# Altium schematic sheet ETHERNET.SchDoc
size C; SheetNumber: 8; SheetTotal: 10
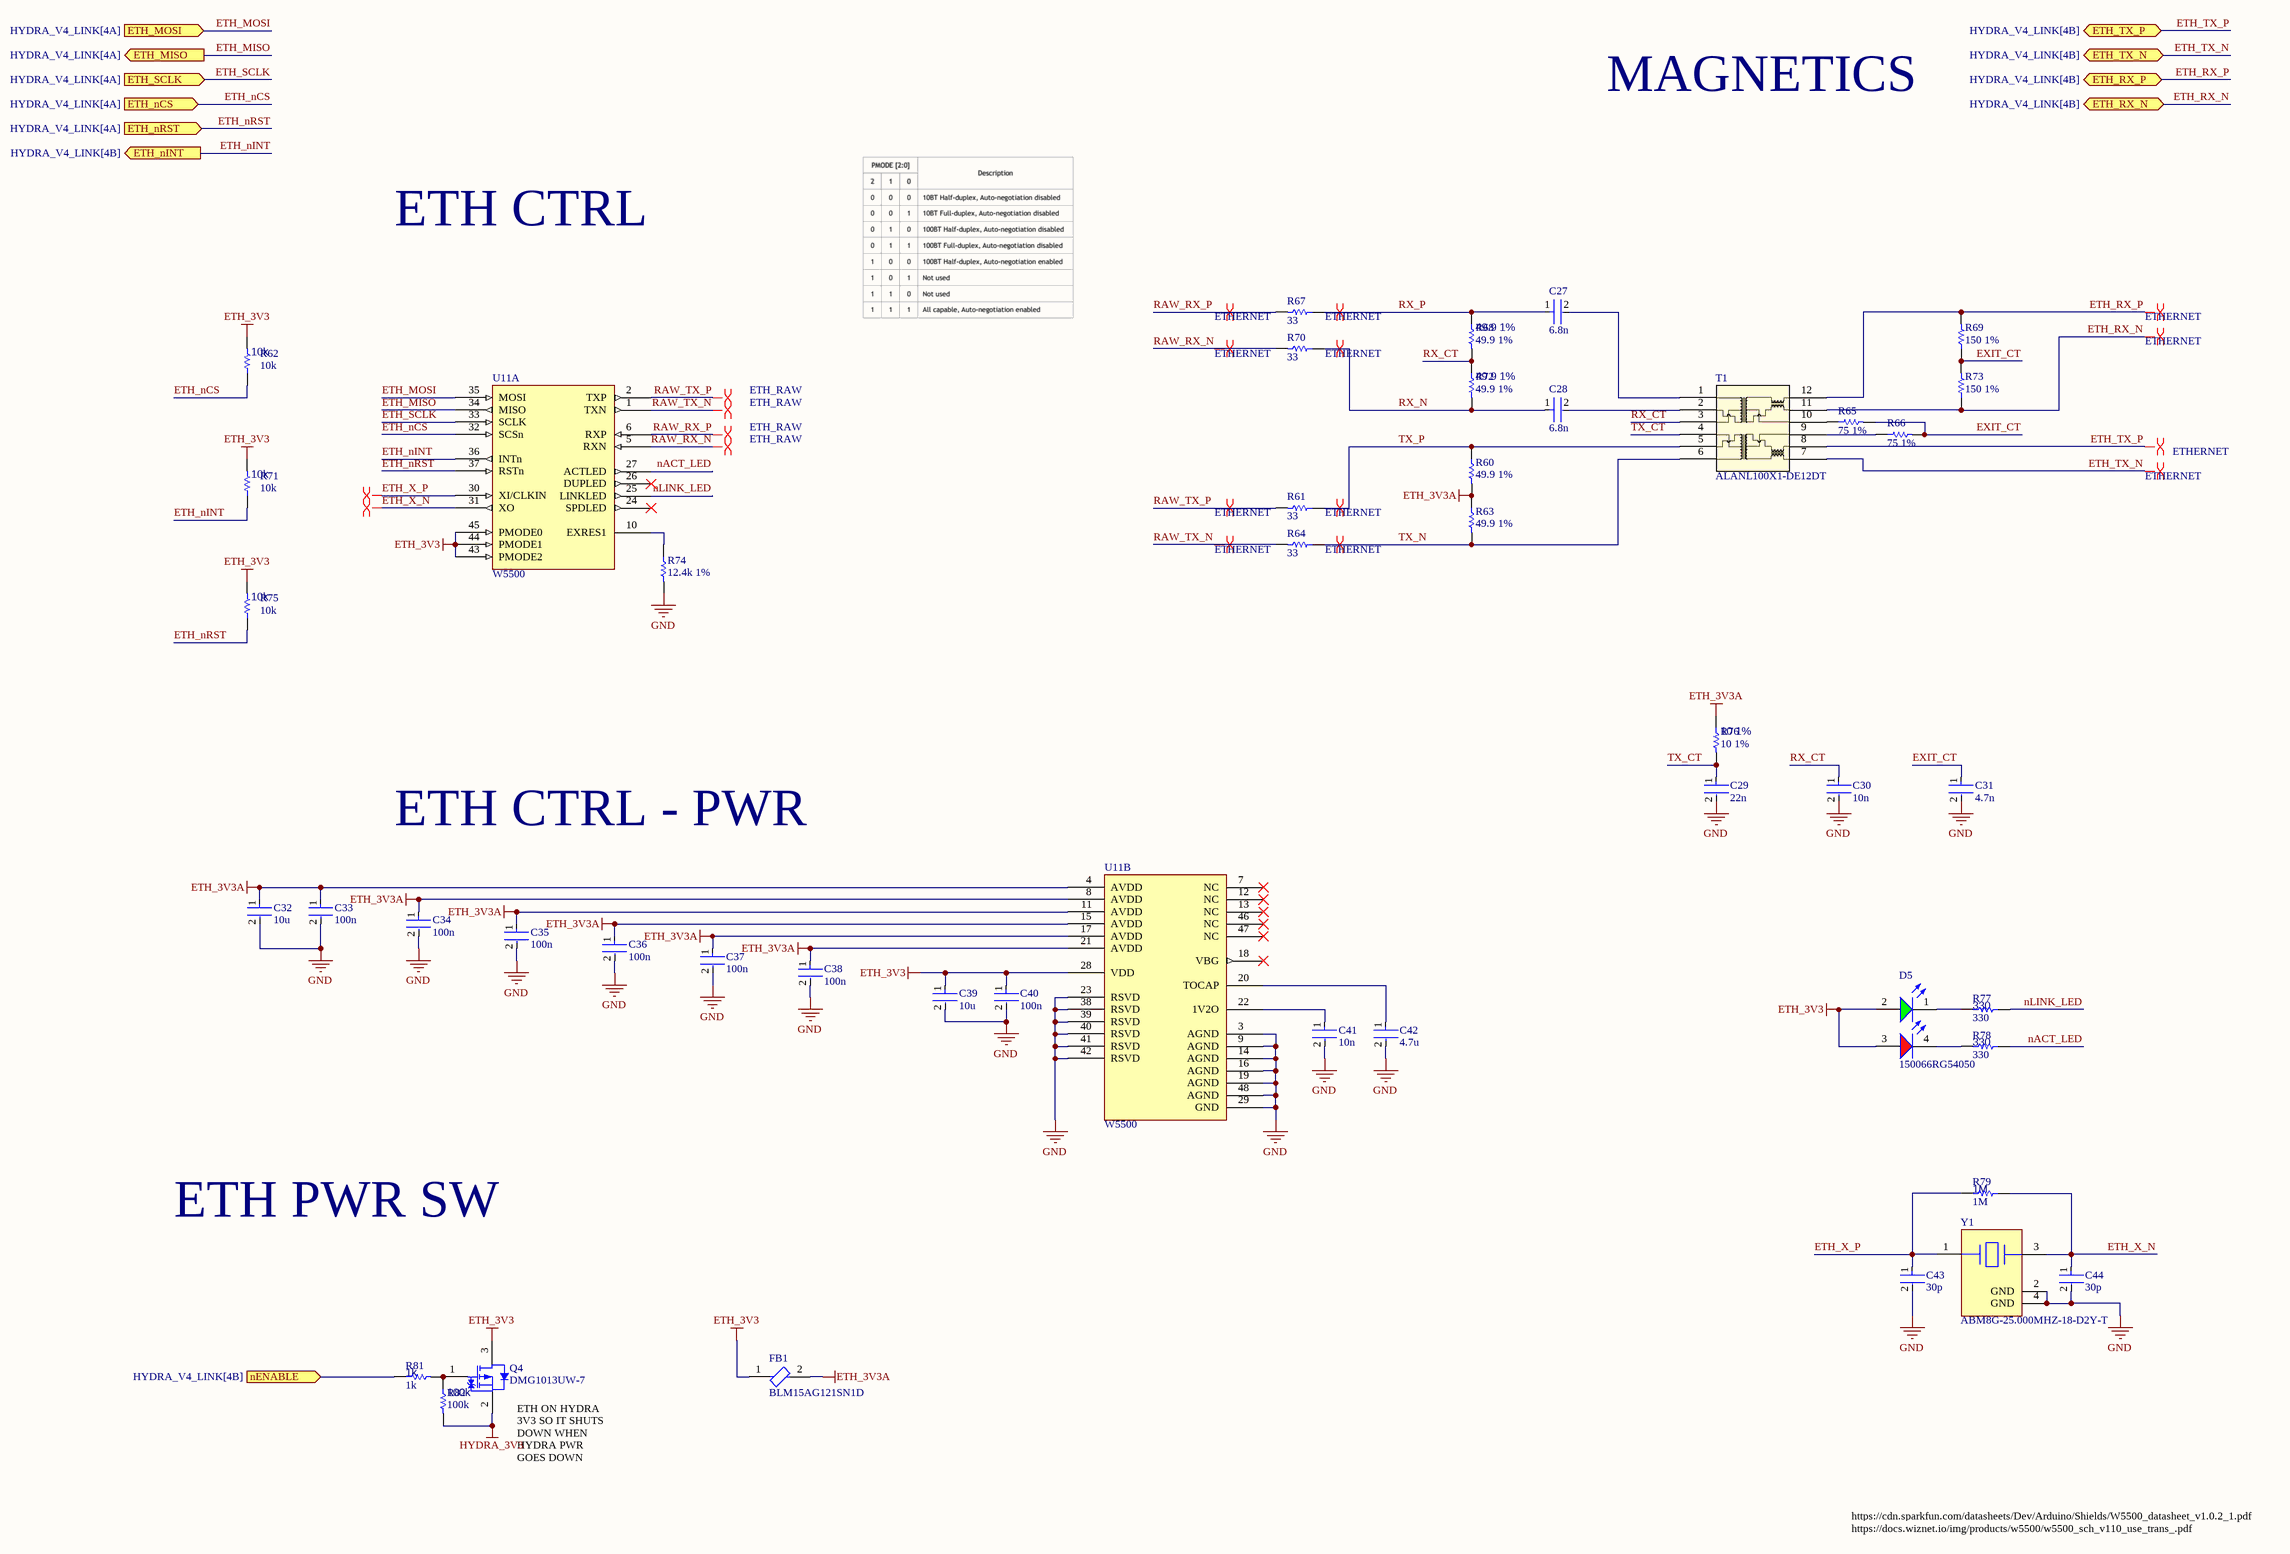
[diagram p0: ETHERNET.SchDoc]

## Parts
C27  6.8n  [FP-0402-L_1_0_0_05-W_0_5-IPC_A]
C28  6.8n  [FP-0402-L_1_0_0_05-W_0_5-IPC_A]
C29  22n  [FP-0402-L_1_0_0_05-W_0_5-IPC_A]
C30  10n  [FP-0402-L_1_0_0_05-W_0_5-IPC_A]
C31  4.7n  [FP-0402-L_1_0_0_05-W_0_5-IPC_A]
C32  10u  [FP-0402-L_1_0_0_05-W_0_5-IPC_A]
C33  100n  [FP-0402-L_1_0_0_05-W_0_5-IPC_A]
C34  100n  [FP-0402-L_1_0_0_05-W_0_5-IPC_A]
C35  100n  [FP-0402-L_1_0_0_05-W_0_5-IPC_A]
C36  100n  [FP-0402-L_1_0_0_05-W_0_5-IPC_A]
C37  100n  [FP-0402-L_1_0_0_05-W_0_5-IPC_A]
C38  100n  [FP-0402-L_1_0_0_05-W_0_5-IPC_A]
C39  10u  [FP-0402-L_1_0_0_05-W_0_5-IPC_A]
C40  100n  [FP-0402-L_1_0_0_05-W_0_5-IPC_A]
C41  10n  [FP-0402-L_1_0_0_05-W_0_5-IPC_A]
C42  4.7u  [FP-0402-L_1_0_0_05-W_0_5-IPC_A]
C43  30p  [FP-0402-L_1_0_0_05-W_0_5-IPC_A]
C44  30p  [FP-0402-L_1_0_0_05-W_0_5-IPC_A]
D5  150066RG54050  [WL-SBCD_0606]
FB1  BLM15AG121SN1D  [FP-BLM15-0_05-MFG]
Q4  DMG1013UW-7  [DIOD-SOT323-3_V]
R60  49.9 1%  [R0603B]
R61  33  [R0603B]
R62  10k  [R0603B]
R63  49.9 1%  [R0603B]
R64  33  [R0603B]
R65  75 1%  [R0603B]
R66  75 1%  [R0603B]
R67  33  [R0603B]
R68  49.9 1%  [R0603B]
R69  150 1%  [R0603B]
R70  33  [R0603B]
R71  10k  [R0603B]
R72  49.9 1%  [R0603B]
R73  150 1%  [R0603B]
R74  12.4k 1%  [R0603B]
R75  10k  [R0603B]
R76  10 1%  [R0603B]
R77  330  [R0603B]
R78  330  [R0603B]
R79  1M  [R0603B]
R81  1k  [R0603B]
R82  100k  [R0603B]
T1  ALANL100X1-DE12DT  [ALANL100X1-DE12DT-Footprint-1]
U11  W5500  [TSQFP50P900X900X160-48N]  (parts A,B of 2)
Y1  ABM8G-25.000MHZ-18-D2Y-T  [FP-ABM8G-MFG]

## Ports
ETH_MISO (out, see HYDRA_V4_LINK[4A]), ETH_MOSI (in, see HYDRA_V4_LINK[4A]), ETH_nCS (in, see HYDRA_V4_LINK[4A]), ETH_nINT (out, see HYDRA_V4_LINK[4B]), ETH_nRST (in, see HYDRA_V4_LINK[4A]), ETH_RX_N (bidir, see HYDRA_V4_LINK[4B]), ETH_RX_P (bidir, see HYDRA_V4_LINK[4B]), ETH_SCLK (in, see HYDRA_V4_LINK[4A]), ETH_TX_N (bidir, see HYDRA_V4_LINK[4B]), ETH_TX_P (bidir, see HYDRA_V4_LINK[4B]), nENABLE (in, see HYDRA_V4_LINK[4B])

## Nets
ETH_3V3: C39.1 C40.1 D5.2(A) D5.3(A) FB1.1 Q4.3(D) R62.2 R71.2 R75.2 U11.28(VDD) U11.43(PMODE2) U11.44(PMODE1) U11.45(PMODE0)
ETH_3V3A: C32.1 C33.1 C34.1 C35.1 C36.1 C37.1 C38.1 FB1.2 R60.2 R63.1 R76.1 U11.4(AVDD) U11.8(AVDD) U11.11(AVDD) U11.15(AVDD) U11.17(AVDD) U11.21(AVDD)
GND: C29.2 C30.2 C31.2 C32.2 C33.2 C34.2 C35.2 C36.2 C37.2 C38.2 C39.2 C40.2 C41.2 C42.2 C43.2 C44.2 R74.2 U11.3(AGND) U11.9(AGND) U11.14(AGND) U11.16(AGND) U11.19(AGND) U11.23(RSVD) U11.29(GND) U11.38(RSVD) U11.39(RSVD) U11.40(RSVD) U11.41(RSVD) U11.42(RSVD) U11.48(AGND) Y1.2(GND) Y1.4(GND)
HYDRA_3V3: Q4.2(S) R82.2
ETH_MISO: U11.34(MISO) ; port ETH_MISO
ETH_MOSI: U11.35(MOSI) ; port ETH_MOSI
ETH_nCS: R62.1 U11.32(SCSn) ; port ETH_nCS
ETH_nINT: R71.1 U11.36(INTn) ; port ETH_nINT
ETH_nRST: R75.1 U11.37(RSTn) ; port ETH_nRST
ETH_RX_N: R73.1 T1.11(MX1-) ; port ETH_RX_N
ETH_RX_P: R69.2 T1.12(MX1+) ; port ETH_RX_P
ETH_SCLK: U11.33(SCLK) ; port ETH_SCLK
ETH_TX_N: T1.7(MX2-) ; port ETH_TX_N
ETH_TX_P: T1.8(MX2+) ; port ETH_TX_P
ETH_X_N: C44.1 R79.1 U11.31(XO) Y1.3
ETH_X_P: C43.1 R79.2 U11.30(XI/CLKIN) Y1.1
EXIT_CT: C31.1 R65.2 R66.2 R69.1 R73.2
nACT_LED: R78.1 U11.27(ACTLED)
nENABLE: R81.1 ; port nENABLE
nLINK_LED: R77.1 U11.25(LINKLED)
RAW_RX_N: R70.2 U11.5(RXN)
RAW_RX_P: R67.2 U11.6(RXP)
RAW_TX_N: R64.2 U11.1(TXN)
RAW_TX_P: R61.2 U11.2(TXP)
RX_CT: C30.1 R68.2 R72.1 T1.3(TCT1)
RX_N: C28.1 R70.1 R72.2
RX_P: C27.1 R67.1 R68.1
TX_CT: C29.1 R76.2 T1.4(TCT2)
TX_N: R63.2 R64.1 T1.6(TD2-)
TX_P: R60.1 R61.1 T1.5(TD2+)
NetC27_2: C27.2 T1.1(TD1+)
NetC28_2: C28.2 T1.2(TD1-)
NetC41_1: C41.1 U11.22(1V2O)
NetC42_1: C42.1 U11.20(TOCAP)
NetD5_1: D5.1(K) R77.2
NetD5_4: D5.4(K) R78.2
NetQ4_1: Q4.1(G) R81.2 R82.1
NetR65_1: R65.1 T1.10(MCT1)
NetR66_1: R66.1 T1.9(MCT2)
NetR74_1: R74.1 U11.10(EXRES1)

Not connected (* = marked no-connect by the designer): U11 7(NC)* 12(NC)* 13(NC)* 18(VBG)* 24(SPDLED)* 26(DUPLED)* 46(NC)* 47(NC)*

## Layout directives
differential pair; differential pair class ETH_RAW: RAW_RX_N, RAW_RX_P, RAW_TX_N, RAW_TX_P
differential pair; differential pair class ETHERNET: ETH_RX_N, ETH_RX_P, ETH_TX_N, ETH_TX_P, RAW_RX_N, RAW_RX_P, RAW_TX_N, RAW_TX_P, RX_N, RX_P, TX_N, TX_P
differential pair: ETH_X_N, ETH_X_P

## Notes on the sheet
- MAGNETICS
- ETH CTRL
- ETH CTRL - PWR
- ETH PWR SW
- (near Q4) ETH ON HYDRA 3V3 SO IT SHUTS DOWN WHEN HYDRA PWR GOES DOWN
- https://cdn.sparkfun.com/datasheets/Dev/Arduino/Shields/W5500_datasheet_v1.0.2_1.pdf
- https://docs.wiznet.io/img/products/w5500/w5500_sch_v110_use_trans_.pdf

## Library data of the parts
C27-C44 = CMP-001-00058-1: LARGE PADS, 0402 CAP, CHANGE COMMENT TO MATCH REAL P/N; Capacitor Type: Ceramic; Min Operating Temperature: -55°C; Mounting Technology: Surface Mount; Pins: 2; Case/Package: 0402; RoHS Compliant: Yes; Max Operating Temperature: 85°C
  C27 C28: Value: 6.8n
  C29: Value: 22n
  C30 C41: Value: 10n
  C31: Value: 4.7n
  C32 C39: Value: 10u
  C33-C38 C40: Value: 100n
  C42: Value: 4.7u
  C43 C44: Value: 30p
D5 = CMP-004-00040-2: Led, Red/Grn, 180Mcd/230Mcd, 624Nm/525Nm Rohs Compliant: Yes; Source: rgled.SchLib; Component Type: Standard; Design Item ID: CMP-004-00034-2; Pins: 4
FB1 = CMP-0686-00170-4: Chip Ferrite Bead, 0402, 120Ω @ 100MHz, 0.19Ω, 25%, 550mA; Material: Steel; Max DC Current: 500mA; Shielding: Unshielded; Number of Lines: 1; DC Resistance (DCR): 190mR; Impedance: 120R; Packaging: Tape and Reel; Core Material: Ferrite; Number of Pins: 2; Tolerance: 25%; Case Code (Imperial): 0402; DC Current: 500mA; Termination: SMD/SMT; Height: 0.5mm; REACH SVHC: No SVHC; Max Operating Temperature: 125°C; Case Code (Metric): 1005; Length: 1mm; Test Frequency: 100MHz; Lead Free: Lead Free; Depth: 0.55mm; Max Current Rating: 550mA; Case/Package: 0402; Min Operating Temperature: -55°C; Width: 0.5mm; Military Standard: Not; Frequency: 100MHz; Current Rating: 550mA; Package Quantity: 1; Number of Circuits: 1; Radiation Hardening: No
Q4 = CMP-2000-06170-1: P-Channel Enhancement Mode MOSFET, 310 mW, 20 V, -55 to 150 degC, 3-Pin SOT-323, RoHS, Tape and Reel; Manufacturer: Diodes Inc; Qg Gate Charge: 0.622nC; Drain-Source On Resistance-Max: 750mO; Rated Power Dissipation: 310mW; Drain-to-Source Voltage [Vdss]: 20V; Package Reference: SOT323; Datasheet Version: Rev. 3-2, 09/2013; Package Description: 3-Pin Small Outline Transistor, Body 2 x 1.25 mm, Pitch 0.65 mm; Mounting Technology: SurfaceMount; Manufacturer URL: http://www.diodes.com/; Datasheet URL: http://www.diodes.com/_files/datasheets/ds31861.pdf; Channel Type: P-Channel
R60-R79 R81 R82 = CMP-009-00002-14: Resistor
  R60 R63 R68 R72: Value: 49.9 1%
  R61 R64 R67 R70: Value: 33
  R62 R71 R75: Value: 10k
  R65 R66: Value: 75 1%
  R69 R73: Value: 150 1%
  R74: Value: 12.4k 1%
  R76: Value: 10 1%
  R77 R78: Value: 330
  R79: Value: 1M
  R81: Value: 1k
  R82: Value: 100k
T1 = CMP-012-00013-1: Datacom Transformer, LAN; 10/100 BASE-TX; ETHERNET Application(s), 1CT:1CT
U11 = CMP-015-0000-2: Ethernet CTLR Single Chip 10Mbps/100Mbps 3.3V 48-Pin LQFP Reel; Max Supply Current: 132mA; Number of Transceivers: 1; Max Supply Voltage: 3.63V; Interface: SPI; Min Supply Voltage: 2.97V; Min Operating Temperature: -40°C; Operating Supply Current: 132mA; Number of Pins: 48; Lead Free: Lead Free; Packaging: Tray; Package Quantity: 250; Case/Package: LQFP; Max Operating Temperature: 85°C
Y1 = CMP-2000-05733-3: Crystal 25MHz ±20ppm (Tol) ±30ppm (Stability) 18pF FUND 60Ω 4-Pin SMD T/R; Series Resistance: 60R; Length: 3.2mm; Depth: 2.5mm; Packaging: Tape and Reel; Min Operating Temperature: -40°C; Operating Frequency: 25 MHz; Lead Free: Lead Free; Number of Pins: 4; Frequency Tolerance: 20ppm; Radiation Hardening: No; Max Operating Temperature: 85°C; Termination: SMD/SMT; Frequency Stability: 30ppm; Frequency: 25MHz; Series: ABM8G; Mount: Surface Mount; Package Quantity: 1000; Height: 0.039inch; Width: 0.098inch; Case/Package: CSMD; ESR (Equivalent Series Resistance): 60R; Load Capacitance: 18pF; Tolerance: 20ppm